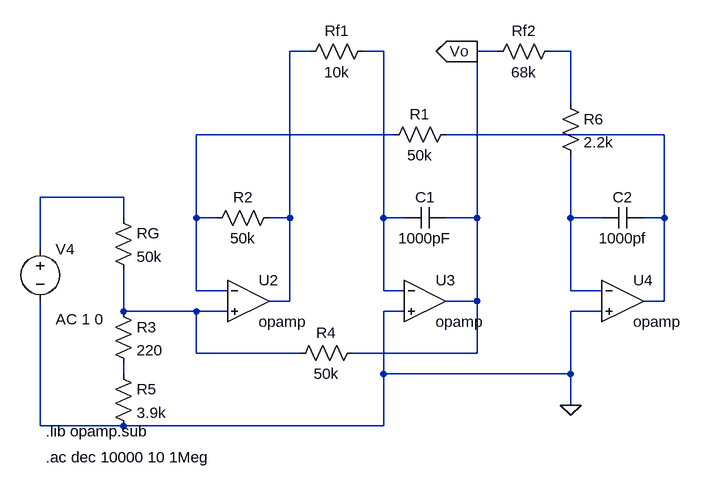
[diagram p0: schematic simulacion_circuito - copia.asc]
simulacion_circuito - copia.asc, the LTspice schematic file:
Version 4
SHEET 1 880 1264
WIRE -304 624 -336 624
WIRE -192 624 -224 624
WIRE -16 624 -48 624
WIRE 96 624 64 624
WIRE 96 704 96 624
WIRE -176 752 -480 752
WIRE 240 752 -96 752
WIRE -592 848 -720 848
WIRE -592 880 -592 848
WIRE -480 880 -480 752
WIRE -448 880 -480 880
WIRE -336 880 -336 624
WIRE -336 880 -368 880
WIRE -192 880 -192 624
WIRE -160 880 -192 880
WIRE -48 880 -48 624
WIRE -48 880 -96 880
WIRE 96 880 96 784
WIRE 144 880 96 880
WIRE 240 880 240 752
WIRE 240 880 208 880
WIRE -720 928 -720 848
WIRE -480 992 -480 880
WIRE -432 992 -480 992
WIRE -192 992 -192 880
WIRE -160 992 -192 992
WIRE 96 992 96 880
WIRE 144 992 96 992
WIRE -336 1008 -336 880
WIRE -336 1008 -368 1008
WIRE -48 1008 -48 880
WIRE -48 1008 -96 1008
WIRE 240 1008 240 880
WIRE 240 1008 208 1008
WIRE -592 1024 -592 960
WIRE -480 1024 -592 1024
WIRE -432 1024 -480 1024
WIRE -160 1024 -192 1024
WIRE 144 1024 96 1024
WIRE -480 1088 -480 1024
WIRE -320 1088 -480 1088
WIRE -48 1088 -48 1008
WIRE -48 1088 -240 1088
WIRE -592 1120 -592 1104
WIRE -192 1120 -192 1024
WIRE 96 1120 96 1024
WIRE 96 1120 -192 1120
WIRE 96 1168 96 1120
WIRE -720 1200 -720 1008
WIRE -592 1200 -720 1200
WIRE -192 1200 -192 1120
WIRE -192 1200 -592 1200
FLAG 96 1168 0
FLAG -48 624 Vo
IOPIN -48 624 Out
SYMBOL OpAmps\\opamp -400 944 R0
SYMATTR InstName U2
SYMBOL OpAmps\\opamp -128 944 R0
SYMATTR InstName U3
SYMBOL OpAmps\\opamp 176 944 R0
SYMATTR InstName U4
SYMBOL res -608 864 R0
SYMATTR InstName RG
SYMATTR Value 50k
SYMBOL res -224 1072 R90
WINDOW 0 0 56 VBottom 2
WINDOW 3 32 56 VTop 2
SYMATTR InstName R4
SYMATTR Value 50k
SYMBOL res -352 864 R90
WINDOW 0 0 56 VBottom 2
WINDOW 3 32 56 VTop 2
SYMATTR InstName R2
SYMATTR Value 50k
SYMBOL res -80 736 R90
WINDOW 0 0 56 VBottom 2
WINDOW 3 32 56 VTop 2
SYMATTR InstName R1
SYMATTR Value 50k
SYMBOL cap -96 864 R90
WINDOW 0 0 32 VBottom 2
WINDOW 3 32 32 VTop 2
SYMATTR InstName C1
SYMATTR Value 1000pF
SYMBOL cap 208 864 R90
WINDOW 0 0 32 VBottom 2
WINDOW 3 32 32 VTop 2
SYMATTR InstName C2
SYMATTR Value 1000pf
SYMBOL res -208 608 R90
WINDOW 0 0 56 VBottom 2
WINDOW 3 32 56 VTop 2
SYMATTR InstName Rf1
SYMATTR Value 10k
SYMBOL res 80 608 R90
WINDOW 0 0 56 VBottom 2
WINDOW 3 32 56 VTop 2
SYMATTR InstName Rf2
SYMATTR Value 68k
SYMBOL voltage -720 912 R0
WINDOW 123 24 124 Left 2
WINDOW 39 0 0 Left 0
SYMATTR Value2 AC 1 0
SYMATTR InstName V4
SYMATTR Value ""
SYMBOL res -608 1008 R0
SYMATTR InstName R3
SYMATTR Value 220
SYMBOL res -608 1104 R0
SYMATTR InstName R5
SYMATTR Value 3.9k
SYMBOL res 80 688 R0
SYMATTR InstName R6
SYMATTR Value 2.2k
TEXT -712 1208 Left 2 !.lib opamp.sub
TEXT -712 1248 Left 2 !.ac dec 10000 10 1Meg

The netlist it stands for:
* simulacion_circuito - copia.asc
XU2 N004 N008 N001 opamp Aol=100K GBW=10Meg  ; pins invin noninvin out
XU3 N002 0 Vo opamp Aol=100K GBW=10Meg  ; pins invin noninvin out
XU4 N007 0 N005 opamp Aol=100K GBW=10Meg  ; pins invin noninvin out
RG N006 N008 50k
R4 Vo N008 50k
R2 N001 N004 50k
R1 N005 N004 50k
C1 Vo N002 1000pF
C2 N005 N007 1000pf
Rf1 N002 N001 10k
Rf2 N003 Vo 68k
V4 N006 0 AC 1 0
R3 N008 N009 220
R5 N009 0 3.9k
R6 N003 N007 2.2k
.lib opamp.sub
.ac dec 10000 10 1Meg
.backanno
.end